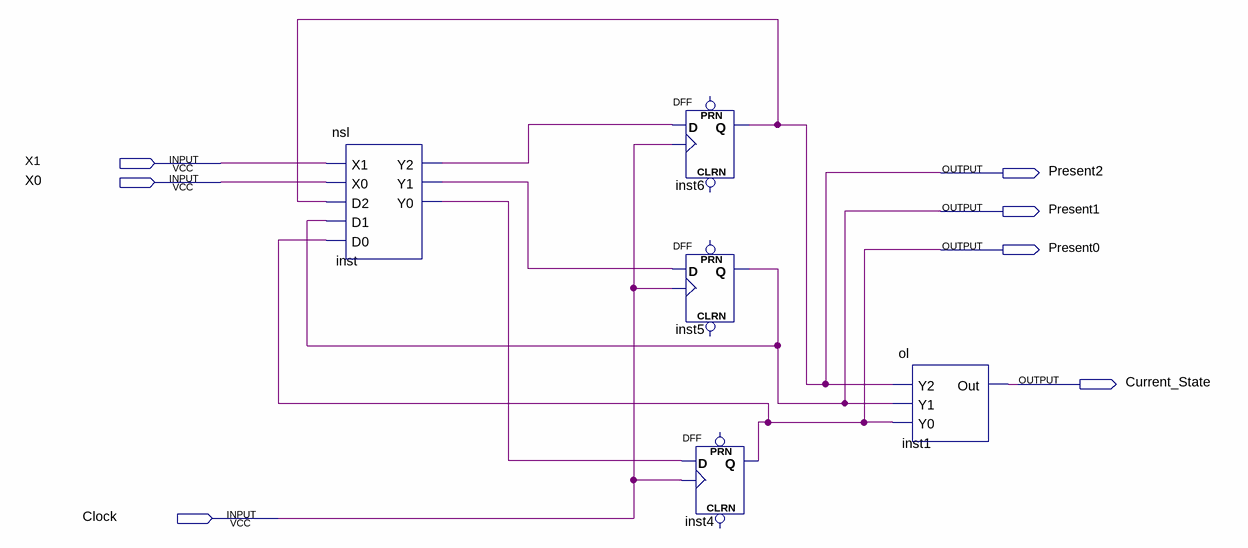
[diagram p0: schematic sheet]
// Quartus schematic FSM.bdf as structural Verilog: 5 symbols, 7 pins
module FSM (
  input  X1,
  input  X0,
  input  Clock,
  output Present2,
  output Present1,
  output Present0,
  output Current_State
);

  wire inst_y0, inst_y1, inst_y2;

  nsl inst (.X1(X1), .X0(X0), .D2(Present2), .D1(Present1), .D0(Present0), .Y2(inst_y2), .Y1(inst_y1), .Y0(inst_y0));
  DFF inst6 (.CLK(Clock), .D(inst_y2), .Q(Present2));  // open: CLRN, PRN
  DFF inst5 (.CLK(Clock), .D(inst_y1), .Q(Present1));  // open: CLRN, PRN
  DFF inst4 (.CLK(Clock), .D(inst_y0), .Q(Present0));  // open: CLRN, PRN
  ol inst1 (.Y2(Present2), .Y1(Present1), .Y0(Present0), .Out(Current_State));
endmodule
